# Altium schematic sheet Dogm128.SchDoc
size A4
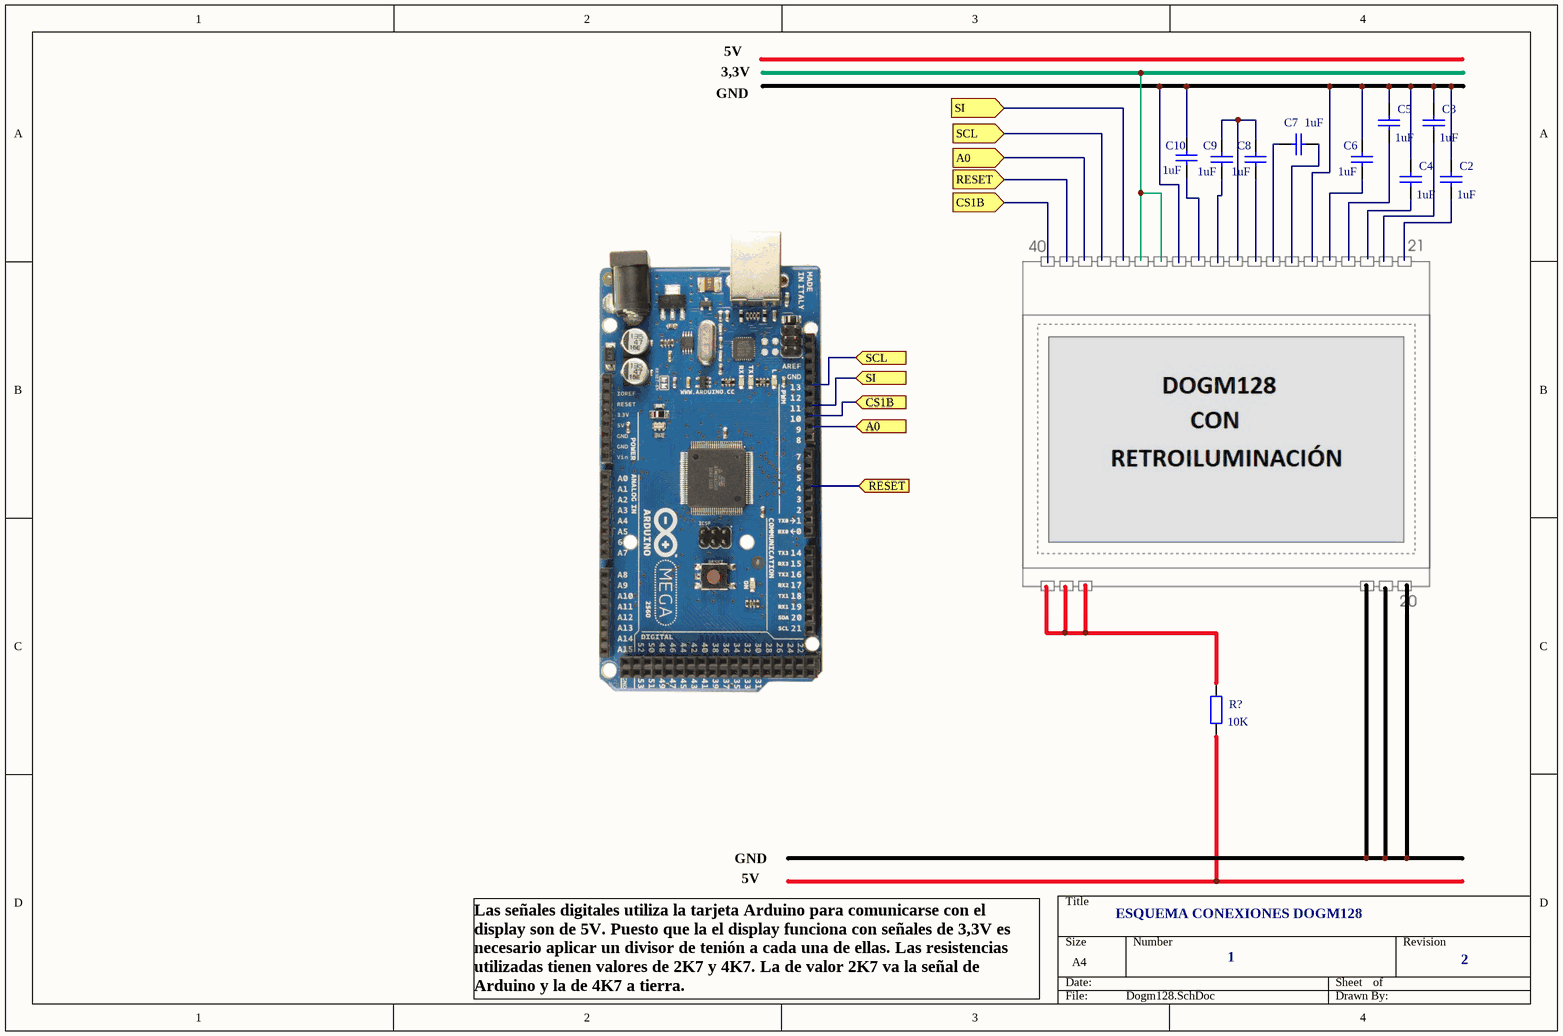
[diagram p0: Dogm128.SchDoc]

## Parts
C2  value 1uF  [RAD-0.3]  (hidden comment: Cap)
C3  value 1uF  [RAD-0.3]  (hidden comment: Cap)
C4  value 1uF  [RAD-0.3]  (hidden comment: Cap)
C5  value 1uF  [RAD-0.3]  (hidden comment: Cap)
C6  value 1uF  [RAD-0.3]  (hidden comment: Cap)
C7  value 1uF  [RAD-0.3]  (hidden comment: Cap)
C8  value 1uF  [RAD-0.3]  (hidden comment: Cap)
C9  value 1uF  [RAD-0.3]  (hidden comment: Cap)
C10  value 1uF  [RAD-0.3]  (hidden comment: Cap)
R?  value 10K  [AXIAL-0.4]  (hidden comment: Res2)

## Ports
A0, CS1B, RESET, SCL, SI

## Nets
NetC2_2: C2.2 C3.2 C4.2 C5.2 C6.2 C10.2
NetC8_2: C8.2 C9.2

Not connected (* = marked no-connect by the designer): C2 1; C3 1; C4 1; C5 1; C6 1; C7 1 2; C8 1; C9 1; C10 1; R? 1 2

## Notes on the sheet
- GND
- 3,3V
- 5V
- ESQUEMA CONEXIONES DOGM128
- 1
- 2
- Las señales digitales utiliza la tarjeta Arduino para comunicarse con el display son de 5V. Puesto que la el display funciona con señales de 3,3V es necesario aplicar un divisor de tenión a cada una de ellas. Las resistencias utilizadas tienen valores de 2K7 y 4K7. La de valor 2K7 va la señal de Arduino y la de 4K7 a tierra.

## Library data of the parts
C2-C10 = Cap: Capacitor; Published: 8-Jun-2000; LatestRevisionDate: 17-Jul-2002; LatestRevisionNote: Re-released for DXP Platform.; PackageReference: RAD-0.3; Publisher: Altium Limited; PackageDescription: Radial Cap, Thru-Hole; 2 Leads; 0.3 in Pin Spacing
R? = Res2: Resistor; Published: 8-Jun-2000; LatestRevisionDate: 17-Jul-2002; LatestRevisionNote: Re-released for DXP Platform.; PackageReference: AXIAL-0.4; Publisher: Altium Limited; PackageDescription: Axial Device, Thru-Hole; 2 Leads; 0.4 in Pin Spacing